# EAGLE design RPi Color Detector PCB v4 (EAGLE 9.1.3)
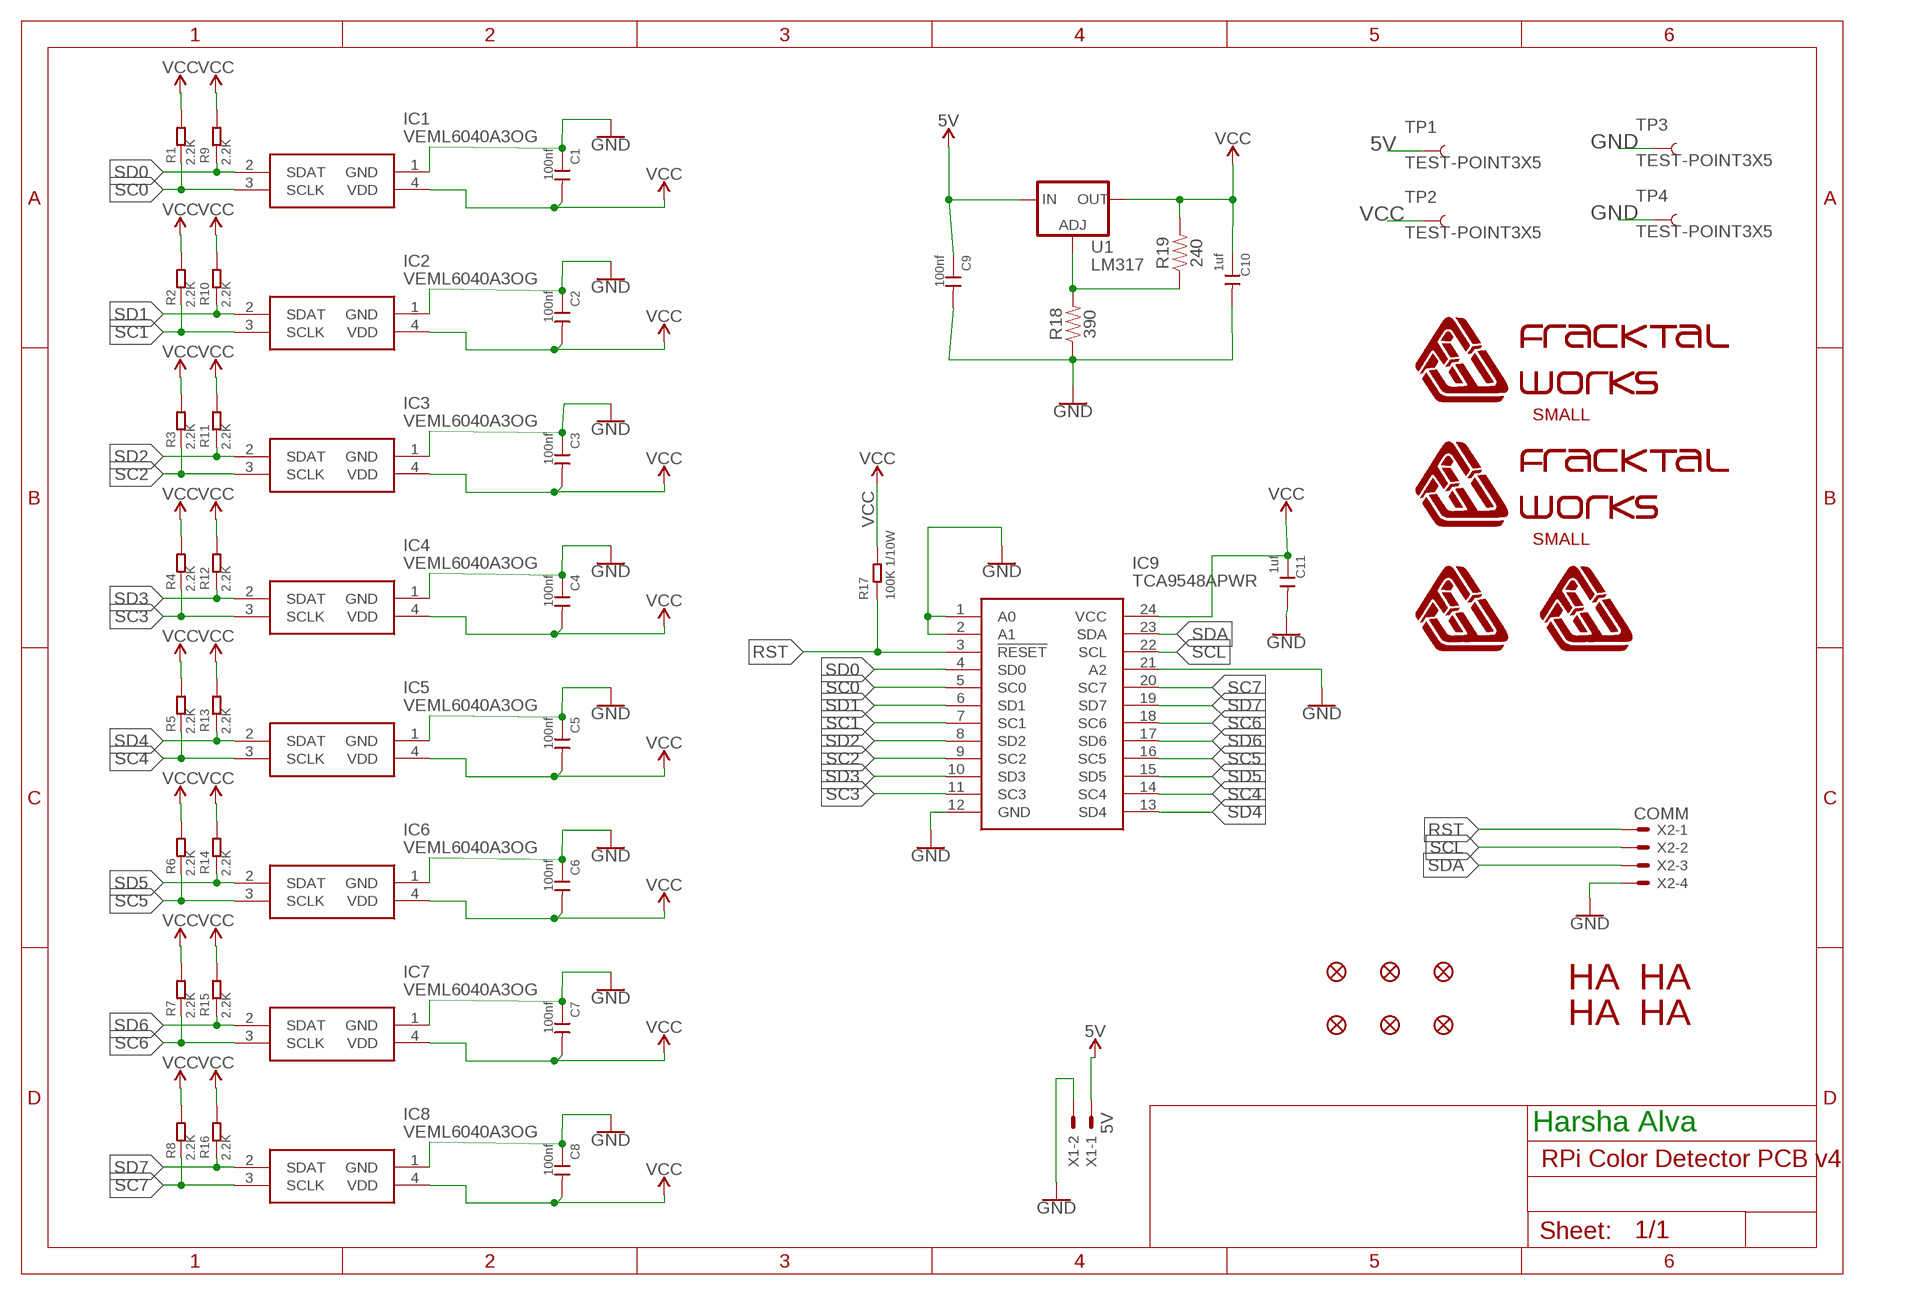
[diagram p0: schematic, sheet 1]

## Parts
C1  100nf  CERAMIC-100NF-25V-10%-X7R(0402)  [C0402]
C2  100nf  CERAMIC-100NF-25V-10%-X7R(0402)  [C0402]
C3  100nf  CERAMIC-100NF-25V-10%-X7R(0402)  [C0402]
C4  100nf  CERAMIC-100NF-25V-10%-X7R(0402)  [C0402]
C5  100nf  CERAMIC-100NF-25V-10%-X7R(0402)  [C0402]
C6  100nf  CERAMIC-100NF-25V-10%-X7R(0402)  [C0402]
C7  100nf  CERAMIC-100NF-25V-10%-X7R(0402)  [C0402]
C8  100nf  CERAMIC-100NF-25V-10%-X7R(0402)  [C0402]
C9  100nf  CERAMIC-100NF-25V-10%-X7R(0402)  [C0402]
C10  1uf  CERAMIC-1UF-10V-10%-X5R(0402)  [C0402]
C11  1uf  CERAMIC-1UF-10V-10%-X5R(0402)  [C0402]
FD1  FIDUCIAL1X2  [FIDUCIAL-1X2]
FD2  FIDUCIAL1X2  [FIDUCIAL-1X2]
FD3  FIDUCIAL1X2  [FIDUCIAL-1X2]
FD4  FIDUCIAL1X2  [FIDUCIAL-1X2]
FD5  FIDUCIAL1X2  [FIDUCIAL-1X2]
FD6  FIDUCIAL1X2  [FIDUCIAL-1X2]
FW_TXT_S_1  FWLOGO_TEXT_SMALL  [FWLOGO_TEXT_SMALL]
FW_TXT_S_2  FWLOGO_TEXT_SMALL  [FWLOGO_TEXT_SMALL]
FWLOGO_1  FWLOGO  [FWLOGO]
FWLOGO_2  FWLOGO  [FWLOGO]
IC1  VEML6040A3OG  [VEML6040A3OG]
IC2  VEML6040A3OG  [VEML6040A3OG]
IC3  VEML6040A3OG  [VEML6040A3OG]
IC4  VEML6040A3OG  [VEML6040A3OG]
IC5  VEML6040A3OG  [VEML6040A3OG]
IC6  VEML6040A3OG  [VEML6040A3OG]
IC7  VEML6040A3OG  [VEML6040A3OG]
IC8  VEML6040A3OG  [VEML6040A3OG]
IC9  TCA9548APWR  [SOP65P640X120-24N]
M_HA_1  HA_MARK  [HA_MARK]
M_HA_2  HA_MARK  [HA_MARK]
M_HA_3  HA_MARK  [HA_MARK]
M_HA_4  HA_MARK  [HA_MARK]
R1  2.2K  SMD-RES-2.2K-5%-1/10W(0603)  [R0603]
R2  2.2K  SMD-RES-2.2K-5%-1/10W(0603)  [R0603]
R3  2.2K  SMD-RES-2.2K-5%-1/10W(0603)  [R0603]
R4  2.2K  SMD-RES-2.2K-5%-1/10W(0603)  [R0603]
R5  2.2K  SMD-RES-2.2K-5%-1/10W(0603)  [R0603]
R6  2.2K  SMD-RES-2.2K-5%-1/10W(0603)  [R0603]
R7  2.2K  SMD-RES-2.2K-5%-1/10W(0603)  [R0603]
R8  2.2K  SMD-RES-2.2K-5%-1/10W(0603)  [R0603]
R9  2.2K  SMD-RES-2.2K-5%-1/10W(0603)  [R0603]
R10  2.2K  SMD-RES-2.2K-5%-1/10W(0603)  [R0603]
R11  2.2K  SMD-RES-2.2K-5%-1/10W(0603)  [R0603]
R12  2.2K  SMD-RES-2.2K-5%-1/10W(0603)  [R0603]
R13  2.2K  SMD-RES-2.2K-5%-1/10W(0603)  [R0603]
R14  2.2K  SMD-RES-2.2K-5%-1/10W(0603)  [R0603]
R15  2.2K  SMD-RES-2.2K-5%-1/10W(0603)  [R0603]
R16  2.2K  SMD-RES-2.2K-5%-1/10W(0603)  [R0603]
R17  100K 1/10W  SMD-RES-100K-5%-1/10W(0603)  [R0603]
R18  390  RESISTOR0603  [0603]
R19  240  RESISTOR0603  [0603]
TP1  TEST-POINT3X5  [PAD.03X.05]
TP2  TEST-POINT3X5  [PAD.03X.05]
TP3  TEST-POINT3X5  [PAD.03X.05]
TP4  TEST-POINT3X5  [PAD.03X.05]
U1  LM317  V_REG_317SMD  [SOT223]
X1  5V  JST-XH-02-PIN-LONG-PAD  [JST-XH-02-PACKAGE-LONG-PAD]
X2  COMM  JST-XH-04-PIN-ROUND-PAD  [JST-XH-04-PACKAGE-ROUND-PAD]

## Nets
5V: C9.1 TP1.P$1 U1.3(IN) X1.1
ADJ: R18.2 R19.1 U1.1(ADJ)
GND: C1.1 C2.1 C3.1 C4.1 C5.1 C6.1 C7.1 C8.1 C9.2 C10.2 C11.2 IC1.1(GND) IC2.1(GND) IC3.1(GND) IC4.1(GND) IC5.1(GND) IC6.1(GND) IC7.1(GND) IC8.1(GND) IC9.1(A0) IC9.2(A1) IC9.12(GND) IC9.21(A2) R18.1 TP3.P$1 TP4.P$1 X1.2 X2.4
RST: IC9.3(!RESET) R17.1 X2.1
SC0: IC1.3(SCLK) IC9.5(SC0) R1.1
SC1: IC2.3(SCLK) IC9.7(SC1) R2.1
SC2: IC3.3(SCLK) IC9.9(SC2) R3.1
SC3: IC4.3(SCLK) IC9.11(SC3) R4.1
SC4: IC5.3(SCLK) IC9.14(SC4) R5.1
SC5: IC6.3(SCLK) IC9.16(SC5) R6.1
SC6: IC7.3(SCLK) IC9.18(SC6) R7.1
SC7: IC8.3(SCLK) IC9.20(SC7) R8.1
SCL: IC9.22(SCL) X2.2
SD0: IC1.2(SDAT) IC9.4(SD0) R9.1
SD1: IC2.2(SDAT) IC9.6(SD1) R10.1
SD2: IC3.2(SDAT) IC9.8(SD2) R11.1
SD3: IC4.2(SDAT) IC9.10(SD3) R12.1
SD4: IC5.2(SDAT) IC9.13(SD4) R13.1
SD5: IC6.2(SDAT) IC9.15(SD5) R14.1
SD6: IC7.2(SDAT) IC9.17(SD6) R15.1
SD7: IC8.2(SDAT) IC9.19(SD7) R16.1
SDA: IC9.23(SDA) X2.3
VCC: C1.2 C2.2 C3.2 C4.2 C5.2 C6.2 C7.2 C8.2 C10.1 C11.1 IC1.4(VDD) IC2.4(VDD) IC3.4(VDD) IC4.4(VDD) IC5.4(VDD) IC6.4(VDD) IC7.4(VDD) IC8.4(VDD) IC9.24(VCC) R1.2 R2.2 R3.2 R4.2 R5.2 R6.2 R7.2 R8.2 R9.2 R10.2 R11.2 R12.2 R13.2 R14.2 R15.2 R16.2 R17.2 R19.2 TP2.P$1 U1.2(OUT)

## Notes on the sheet
- Harsha Alva

## Library data of the parts
C1-C9 = Seeed-Capacitor:CERAMIC-100NF-25V-10%-X7R(0402): 302010024; MPN: CC0402KRX7R8BB104
C10 C11 = Seeed-Capacitor:CERAMIC-1UF-10V-10%-X5R(0402): 302010040; MPN: CC0402KRX5R6BB105
FD1-FD6 = SparkFun-Aesthetics:FIDUCIAL: Fiducial Alignment Points Point-of-reference for pick-and-place machines and other optical instruments.
FW_TXT_S_1 FW_TXT_S_2 = FracktalWorks:FWLOGO_TEXT_SMALL
FWLOGO_1 FWLOGO_2 = FracktalWorks:FWLOGO: Fracktal Works Logo without name
IC1-IC8 = SamacSys_Parts:VEML6040A3OG: VISHAY - VEML6040A3OG - COLOUR SENSOR, 3.6V, 16BIT, DIGITAL Source: Datasheet <http://www.vishay.com/docs/84276/veml6040.pdf>; ARROW_PART_NUMBER: VEML6040A3OG; ARROW_PRICE-STOCK: https://www.arrow.com/en/products/veml6040a3og/vishay; DESCRIPTION: VISHAY - VEML6040A3OG - COLOUR SENSOR, 3.6V, 16BIT, DIGITAL; HEIGHT: mm; MANUFACTURER_NAME: Vishay; MANUFACTURER_PART_NUMBER: VEML6040A3OG; MOUSER_PART_NUMBER: 78-VEML6040A3OG; MOUSER_PRICE-STOCK: https://www.mouser.co.uk/ProductDetail/Vishay-Semiconductors/VEML6040A3OG?qs=uWNRbsI0ZdO85N24FCwIew%3D%3D
IC9 = SamacSys_Parts:TCA9548APWR: TEXAS INSTRUMENTS - TCA9548APWR - I2C SWITCH W/ RESET, 8-CH, TSSOP-24 Source: Datasheet <http://www.ti.com/lit/ds/symlink/tca9548a.pdf>; DESCRIPTION: TEXAS INSTRUMENTS - TCA9548APWR - I2C SWITCH W/ RESET, 8-CH, TSSOP-24; HEIGHT: 1.2mm; MANUFACTURER_NAME: Texas Instruments; MANUFACTURER_PART_NUMBER: TCA9548APWR; MOUSER_PART_NUMBER: 595-TCA9548APWR; MOUSER_PRICE-STOCK: https://www.mouser.co.uk/ProductDetail/Texas-Instruments/TCA9548APWR?qs=iFaFN7AS2WF%252BqSiJMbdYwQ%3D%3D
M_HA_1-M_HA_4 = FracktalWorks:HA_MARK: Maker mark
R1-R16 = Seeed-Resistor:SMD-RES-2.2K-5%-1/10W(0603): 301010124; MPN: RC0603JR-072K2L
R17 = Seeed-Resistor:SMD-RES-100K-5%-1/10W(0603): 301010089; MPN: RC0603JR-07100KL
R18 R19 = SparkFun-Resistors:RESISTOR: Generic Resistor Package
TP1-TP4 = SparkFun-Connectors:TEST-POINT: SparkFun Test Points Bare copper test points for troubleshooting or In-Circuit-Testing. These are used by our Production team for verifying production board runs using pogo-pins on test beds. SparkFun Products: SparkFun LSM9DS1 Breakout <https://www.sparkfun.com/products/13284> SparkFun PSOC <https://www.sparkfun.com/products/13714> SparkFun Load Cell Amplifier <https://www.sparkfun.com/products/13879>
U1 = SparkFun-IC-Power:V_REG_317: Voltage Regulator Standard LM317 adjustable voltage regulator. AOI (Adjust Output Input). Google 'LM317 Calculator' for easy to use app to get the two resistor values needed. 240/720 for 5V output. 240/390 for 3.3V output. Spark Fun Electronics SKU : COM-00527
X1 = Rembrandt Electronics - JST XH Connectors v1-0:JST-XH-02-PIN: JST XH Connector 2 Pin Wire to board connector. Pitch: 2,54 mm, (0.100") Number of pins: 2 Created by Rembrandt Electronics www.rembrandtelectronics.com
X2 = Rembrandt:JST-XH-04-PIN: JST XH Connector 2 Pin Wire to board connector. Pitch: 2,54 mm, (0.100") Number of pins: 4 Created by Rembrandt Electronics www.rembrandtelectronics.com

## Board
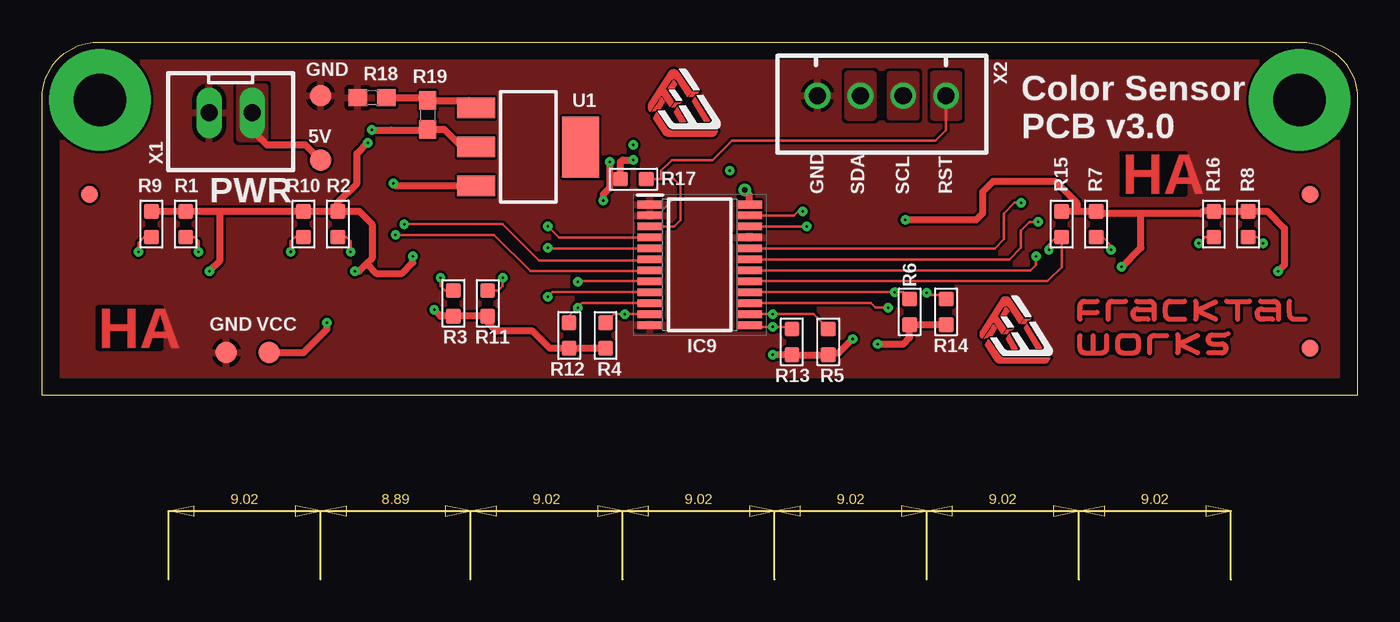
[diagram p1: board, top side]
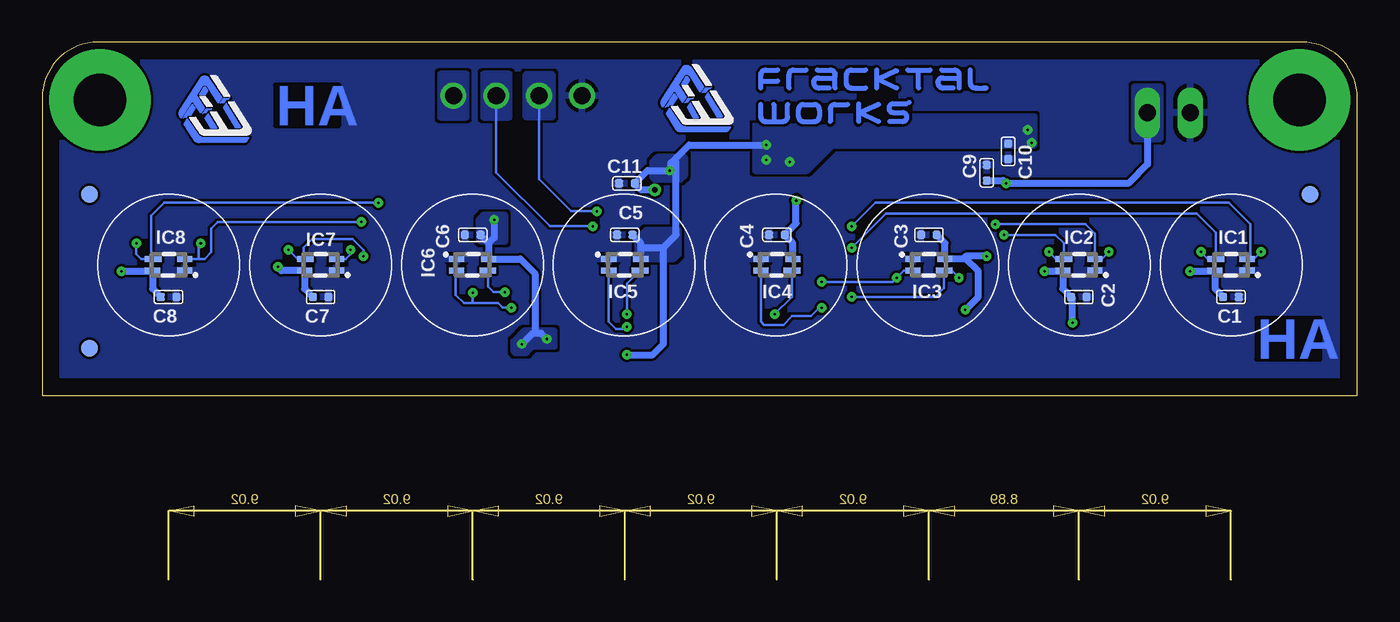
[diagram p2: board, bottom side, seen from below]

Size 77.98 x 20.95 mm. Coordinates in mm from the lower left corner, seen from the top.
Outline: 77.98,17.65 77.98,0 0,0 0,17.65 arc-90 3.3,20.95 3.43,20.95 74.68,20.95 arc-90 77.98,17.65
Copper layers (1*16): Top 0.035mm / dielectric 1.5mm / Bottom 0.035mm
Design rules "default *": minimum track width 6mil, minimum drill 0.15mm, track to track 6mil, track to pad 6mil, pad to pad 6mil, via to via 6mil, smd to smd 6mil, copper to edge 40mil, drill to drill 6mil, minimum pad ring 10mil, minimum via ring 8mil, stop-mask expansion 4mil, vias tented up to drill 0mil, thermal gap 10mil

### Footprints (pad centres in the part's own frame; a part is rotated, then mirrored left to right if it is on the bottom)
C0402 = smd 0.5 x 0.5: 1 0,0.463; 2 0,-0.463
FIDUCIAL-1X2 = smd 1 x 1: 1 0,0
VEML6040A3OG = smd 0.9 x 0.35: 1 -0.95,0.35; 2 -0.95,-0.35; 4 0.95,0.35 | smd 1 x 0.35: 3 0.9,-0.35
SOP65P640X120-24N = smd 1.475 x 0.45: 1 -2.938,3.575; 2 -2.938,2.925; 3 -2.938,2.275; 4 -2.938,1.625; 5 -2.938,0.975; 6 -2.938,0.325; 7 -2.938,-0.325; 8 -2.938,-0.975; 9 -2.938,-1.625; 10 -2.938,-2.275; 11 -2.938,-2.925; 12 -2.938,-3.575; 13 2.938,-3.575; 14 2.938,-2.925; 15 2.938,-2.275; 16 2.938,-1.625; 17 2.938,-0.975; 18 2.938,-0.325; 19 2.938,0.325; 20 2.938,0.975; 21 2.938,1.625; 22 2.938,2.275; 23 2.938,2.925; 24 2.938,3.575
R0603 = smd 0.889 x 0.889: 1 0,0.762; 2 0,-0.762
0603 = smd 1.1 x 1: 1 -0.85,0; 2 0.85,0
PAD.03X.05 = smd 1.27 x 1.27: P$1 0,0
SOT223 = smd 1.219 x 2.235: 1 -2.311,-3.099; 2 0,-3.099; 3 2.311,-3.099 | smd 3.6 x 2.2: 4 0,3.099
JST-XH-02-PACKAGE-LONG-PAD = drill 1.016 long: 1 -1.27,0; 2 1.27,0
JST-XH-04-PACKAGE-ROUND-PAD = drill 1.016: 1 -3.81,0; 2 -1.27,0; 3 1.27,0; 4 3.81,0

### Placement (x,y rotation side)
C1  7.49,5.84 270 bottom
C2  16.51,5.84 270 bottom
C3  25.4,9.53 90 bottom
C4  34.42,9.53 90 bottom
C5  43.43,9.53 90 bottom
C6  52.45,9.53 90 bottom
C7  61.47,5.84 270 bottom
C8  70.48,5.84 270 bottom
C9  21.97,13.21 180 bottom
C10  20.7,14.48 0 bottom
C11  43.31,12.57 270 bottom
FD1  2.79,11.94 0 top
FD2  2.79,11.94 0 bottom
FD3  75.18,11.94 0 top
FD4  75.18,11.94 0 bottom
FD5  75.18,2.79 0 top
FD6  75.18,2.79 0 bottom
FW_TXT_S_1  41.53,14.48 0 bottom
FW_TXT_S_2  55.37,0.76 0 top
FWLOGO_1  34.42,14.22 0 top
FWLOGO_2  71.37,13.84 0 bottom
IC1  7.49,7.75 180 bottom
IC2  16.51,7.75 180 bottom
IC3  25.4,7.75 0 bottom
IC4  34.42,7.75 0 bottom
IC5  43.43,7.75 0 bottom
IC6  52.45,7.75 0 bottom
IC7  61.47,7.75 180 bottom
IC8  70.48,7.75 180 bottom
IC9  38.99,7.75 0 top
M_HA_1  64.01,11.94 0 top
M_HA_2  64.14,16 0 bottom
M_HA_3  3.3,2.79 0 top
M_HA_4  5.97,2.16 0 bottom
R1  8.51,10.16 180 top
R2  17.53,10.16 180 top
R3  24.38,5.46 0 top
R4  33.4,3.56 0 top
R5  46.61,3.17 0 top
R6  51.44,4.95 0 top
R7  62.48,10.16 180 top
R8  71.5,10.16 180 top
R9  6.48,10.16 180 top
R10  15.49,10.16 180 top
R11  26.42,5.46 0 top
R12  31.24,3.56 0 top
R13  44.45,3.17 0 top
R14  53.59,4.95 0 top
R15  60.45,10.16 180 top
R16  69.47,10.16 180 top
R17  35.05,12.83 270 top
R18  19.56,17.65 0 top
R19  22.86,16.64 270 top
TP1  16.51,13.97 0 top
TP2  13.46,2.54 0 top
TP3  16.51,17.78 0 top
TP4  10.92,2.54 0 top
U1  28.83,14.73 270 top
X1  11.18,16.76 180 top
X2  49.78,17.78 180 top

### Tracks (layer width: path | path; a pad name or v marks a point on that pad's centre or on a via)
5V  (via drill 0.15)
  Top 0.406: TP1.P$1 15.62,14.86 13.34,14.86 12.45,15.75 X1.1 | U1.3 20.98,12.42 v20.83,12.57
  Bottom 0.406: X1.1 12.45,13.72 13.59,12.57 v20.83,12.57 21,12.74 C9.1
  pour Top (no thermals): 11.68,18.29 11.68,15.24 13.21,15.24 13.21,18.29
  pour Bottom (no thermals): 11.68,18.29 13.21,18.29 13.21,15.24 11.68,15.24
ADJ
  Top 0.406: U1.1 25.29,17.49 R19.1 22.69,17.65 R18.2
GND
  pour Top (rank 2): -6.99,21.84 83.95,21.84 83.95,-2.29 -6.99,-2.29
  pour Bottom (rank 2): -8.26,23.11 85.34,23.11 85.34,-3.56 -8.26,-3.56
N$2  (via drill 3.1 pad 6)
  other vias: 74.55,17.53
N$3  (via drill 3.1 pad 6)
  other vias: 3.43,17.53
RST
  Top 0.152: R17.1 36.7,12.83 | 36.7,12.83 37.47,12.83 37.85,12.45 37.85,10.41 37.45,10.02 IC9.3 | X2.1 53.59,15.75 52.96,15.11 40.89,15.11 39.75,13.97 37.34,13.97 36.7,13.34 36.7,12.83
  pour Bottom (no thermals): 52.83,19.05 54.36,19.05 54.36,16.51 52.83,16.51
  pour Top (no thermals): 52.83,19.05 52.83,16.51 54.36,16.51 54.36,19.05
SC0  (via drill 0.15)
  Top 0.152: v29.97,8.76 30.01,8.72 IC9.5 | R1.1 9.02,9.4 9.27,9.14 v9.27,8.51
  Bottom 0.152: v29.97,8.76 27.94,10.79 9.53,10.79 8.39,9.66 IC1.3 8.86,8.1 v9.27,8.51
SC1  (via drill 0.15)
  Top 0.152: v20.95,9.53 26.8,9.53 28.96,7.37 33.4,7.37 35.99,7.37 IC9.7 | v18.29,8.51 18.29,9.14 18.03,9.4 R2.1
  Bottom 0.152: v20.95,9.53 17.91,9.53 17.41,9.03 IC2.3 17.88,8.1 v18.29,8.51
SC2  (via drill 0.15)
  Top 0.152: IC9.9 30.25,6.12 v29.97,5.84 | R3.1 23.88,6.22 23.62,6.48 v23.62,6.99
  Bottom 0.152: v29.97,5.84 25.02,5.84 24.5,6.36 IC3.3 24.03,7.4 v23.62,6.99
SC3  (via drill 0.15)
  Top 0.152: IC9.11 v34.54,4.82 33.91,4.82 R4.1
  Bottom 0.152: IC4.3 33.52,5.85 v34.54,4.82
SC4  (via drill 0.15)
  Top 0.152: IC9.14 v43.31,4.82 45.72,4.82 R5.1
  Bottom 0.152: IC5.3 43.31,6.62 v43.31,4.82
SC5  (via drill 0.15)
  Top 0.152: IC9.16 v50.55,6.12 51.03,6.12 R6.1
  Bottom 0.152: v50.55,6.12 51.21,6.12 51.55,6.47 IC6.3
SC6  (via drill 0.15)
  Top 0.152: IC9.18 51.44,7.42 58.6,7.42 58.93,7.75 v58.93,8.26 | v63.37,8.64 63.37,8.89 62.85,9.42 62.83,9.4 62.52,9.4 62.5,9.42 R7.1
  Bottom 0.152: IC7.3 62.48,8.1 | 62.48,8.1 62.83,8.1 v63.37,8.64 | v58.93,8.26 58.93,8.64 59.56,9.27 61.98,9.27 62.48,8.76 62.48,8.1
SC7  (via drill 0.15)
  Top 0.152: IC9.20 56.47,8.72 57.02,9.27 57.02,10.79 57.66,11.43 v58.04,11.43 | R8.1 72.01,9.4 v72.39,9.02
  Bottom 0.152: v72.39,9.02 72.39,8.38 72.11,8.1 71.5,8.1 | 71.5,8.1 IC8.3 | v58.04,11.43 70.74,11.43 71.5,10.67 71.5,10.41 71.5,8.1
SCL  (via drill 0.15)
  Top 0.152: IC9.22 45.33,10.02 v45.34,10.03
  Bottom 0.152: v45.34,10.03 47.88,10.03 51.05,13.21 X2.2
  pour Top (no thermals): 50.29,19.05 51.82,19.05 51.82,16.51 50.29,16.51
  pour Bottom (no thermals): 50.29,19.05 51.82,19.05 51.82,16.51 50.29,16.51
SD0  (via drill 0.15)
  Top 0.152: IC9.4 30.63,9.37 v29.97,10.03 | v5.71,8.51 5.71,9.06 6.05,9.4 R9.1
  Bottom 0.152: v29.97,10.03 28.57,11.43 7.62,11.43 6.35,10.16 6.35,8.29 IC1.2 6.13,8.1 v5.71,8.51
SD1  (via drill 0.15)
  Top 0.152: v21.46,10.16 27.3,10.16 29.46,8 35.98,8 IC9.6 | v14.73,8.51 14.73,9.14 14.99,9.4 R10.1
  Bottom 0.152: v21.46,10.16 16.13,10.16 15.56,9.59 IC2.2 15.14,8.1 v14.73,8.51
SD2  (via drill 0.15)
  Top 0.152: IC9.8 31.79,6.77 v31.75,6.73 | R11.1 27.05,6.22 27.3,6.48 v27.3,6.99
  Bottom 0.152: IC3.2 26.89,7.4 v27.3,6.99 27.56,6.73 v31.75,6.73
SD3  (via drill 0.15)
  Top 0.152: IC9.10 32.02,5.47 v31.75,5.21 31.24,4.7 R12.1
  Bottom 0.152: IC4.2 35.37,4.38 35.18,4.19 34.04,4.19 33.53,4.7 32.38,4.7 31.88,5.21 v31.75,5.21
SD4  (via drill 0.15)
  Top 0.152: IC9.13 42.03,4.27 42.24,4.06 v43.31,4.06 44.4,4.06 R13.1
  Bottom 0.152: IC5.2 44.38,4.38 43.94,3.94 43.43,3.94 v43.31,4.06
SD5  (via drill 0.15)
  Top 0.152: R14.1 53.55,5.97 52.58,5.97 v52.45,6.1 | v50.16,5.21 49.4,5.21 49.14,5.47 IC9.15
  Bottom 0.152: 52.45,5.47 52.32,5.47 50.94,5.47 50.67,5.21 v50.16,5.21 | 52.45,5.47 52.97,5.47 53.47,5.97 53.47,6.6 53.47,7.33 IC6.2 | 52.45,5.47 v52.45,6.1
SD6  (via drill 0.15)
  Top 0.152: v59.69,8.64 59.69,8.94 60.2,9.44 R15.1 60.45,7.62 59.6,6.77 IC9.17
  Bottom 0.152: IC7.2 59.98,8.1 59.69,8.38 v59.69,8.64
SD7  (via drill 0.15)
  Top 0.152: IC9.19 51.56,8.07 57.35,8.07 58.04,8.76 58.04,9.78 58.55,10.29 v59.05,10.29 | R16.1 68.96,9.4 v68.58,9.02
  Bottom 0.152: v59.05,10.29 67.56,10.29 67.94,9.91 67.94,8.51 68.36,8.1 68.71,8.1 | 68.71,8.1 IC8.2 | v68.58,9.02 68.71,8.89 68.71,8.1
SDA  (via drill 0.15)
  Top 0.152: IC9.23 44.58,10.67 44.83,10.92 v45.09,10.92
  Bottom 0.152: v45.09,10.92 46.61,10.92 48.51,12.83 X2.3
  pour Top (no thermals): 47.75,19.05 47.75,16.51 49.28,16.51 49.28,19.05
  pour Bottom (no thermals): 47.75,19.05 47.75,16.51 49.28,16.51 49.28,19.05
VCC  (via drill 0.15, 0.35)
  Top 0.406: U1.2 25.6,14.61 25.02,14.61 23.84,15.79 R19.2 22.82,15.75 20.7,15.75 v19.56,15.75 | R9.2 R1.2 10.54,10.92 | R2.2 R10.2 10.54,10.92 | R4.2 R12.2 30.1,2.79 29.08,3.81 26.92,3.81 26.42,4.32 R11.2 R3.2 23.62,4.7 v23.24,5.08 | R2.2 17.53,11.43 18.67,12.57 18.67,14.35 v19.3,14.99 | v9.91,7.37 10.54,8 10.54,10.92 | 19.24,7.81 19.56,8.13 19.56,10.16 18.8,10.92 R2.2 | 19.24,7.81 18.8,7.37 v18.54,7.37 | v73.28,7.37 73.66,7.75 73.66,9.91 72.64,10.92 R8.2 R16.2 68.82,10.92 68.68,10.78 65.15,10.78 | v33.27,11.56 33.27,11.94 33.66,12.32 v33.66,13.84 | R14.2 R6.2 51.44,3.43 51.05,3.05 v49.53,3.05 | v51.18,10.41 55.37,10.41 55.75,10.79 55.75,12.06 56.39,12.7 60.07,12.7 61.34,11.43 61.34,10.92 | 19.24,7.81 19.81,7.24 21.34,7.24 21.97,7.87 v21.97,8.26 | TP2.P$1 15.49,2.54 16.89,3.94 v16.89,4.32 | v43.31,2.41 R13.2 R5.2 47.25,2.55 v48.05,3.35 | R15.2 61.34,10.92 | 61.34,10.92 R7.2 62.63,10.78 65.15,10.78 | v64.01,7.62 65.15,8.76 65.15,10.78 | R17.2 34.29,13.84 34.42,13.97 v35.05,13.97 | IC9.24 41.93,11.92 v41.66,12.19
  Bottom 0.152: IC1.4 8.44,7.37 | IC8.4 71.44,7.37
  Bottom 0.406: C1.2 8.44,6.33 8.44,7.37 v9.91,7.37 | C3.2 24.45,9.04 IC3.4 23.37,8.1 | IC4.4 33.47,9.04 C4.2 33.27,10.21 v33.27,11.56 | IC5.4 42.48,8.76 | 42.48,8.76 42.48,9.04 C5.2 | C6.2 51.5,9.04 | 51.5,9.04 IC6.4 49.63,8.1 48.77,7.24 48.77,5.59 48.77,3.68 | C7.2 62.42,6.33 IC7.4 63.78,7.4 v64.01,7.62 | C8.2 71.44,6.33 71.44,7.37 v73.28,7.37 | 40.32,14.16 40.7,13.78 40.7,13.4 v40.77,13.34 42.08,13.34 C11.1 42.46,12.19 v41.66,12.19 | 40.32,14.16 39.62,14.86 v35.05,14.86 | v18.54,7.37 17.49,7.37 IC2.4 17.46,6.33 C2.2 16.89,5.76 v16.89,4.32 | v48.05,3.35 48.39,3.68 48.77,3.68 | 48.77,3.68 48.9,3.68 v49.53,3.05 | v51.18,10.41 51.18,9.36 51.5,9.04 | v23.24,5.08 22.48,5.84 22.48,7.37 23.21,8.1 23.37,8.1 | 42.48,8.76 | 42.48,8.76 41.15,8.76 | 41.15,8.76 40.39,9.53 40.39,14.1 40.32,14.16 | v21.97,8.26 23.21,8.26 23.37,8.1 | v43.31,2.41 41.78,2.41 41.15,3.05 41.15,8.76
  pour Bottom (no thermals): 19.18,16.51 35.69,16.51 35.69,13.34 32.64,13.34 31.11,14.86 19.18,14.86
  pour Bottom (no thermals): 50.55,10.67 51.82,10.67 52.07,10.41 52.07,9.27 51.94,9.14 50.55,9.14
  pour Bottom (no thermals): 47.62,3.81 49.4,3.81 50.04,3.17 50.04,2.67 49.91,2.54 49.28,2.54 48.9,2.92 47.62,2.92
  pour Bottom (no thermals): 39.88,14.1 41.53,14.1 41.66,13.97 41.78,13.84 41.78,12.95 41.66,12.83 40.51,12.83 40.13,12.83 39.88,13.08
  pour Bottom (no thermals): 40.26,9.78 42.16,9.78 42.67,9.27 42.67,8.13 40.51,8.13 40.26,8.38

### Text on the board
tPlace: GND | 5V | Color Sensor / PCB v3.0 | GND | VCC
tNames: GND | SDA | SCL | RST | PWR